# Altium schematic sheet [23] - SENSORS, CAN, IR.SchDoc
size A2; DocumentNumber: 23; SheetNumber: 23; SheetTotal: 32
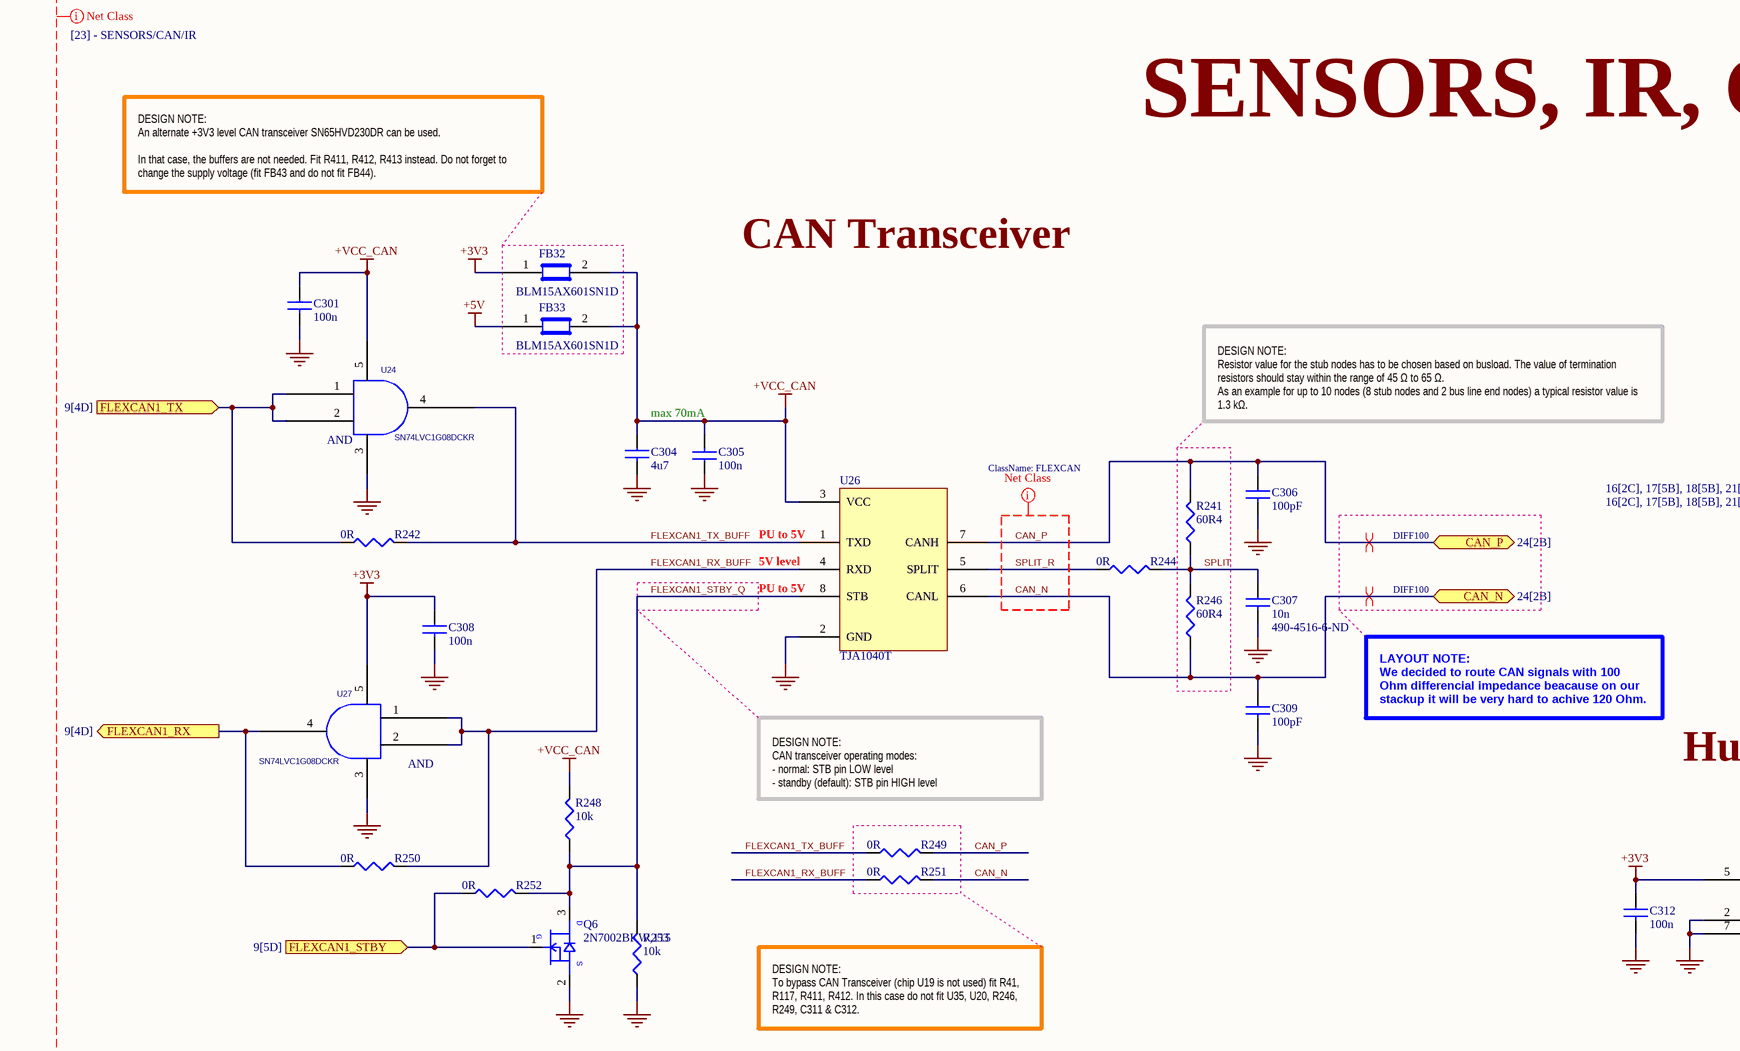
[diagram p0: [23] - SENSORS, CAN, IR.SchDoc, top left]
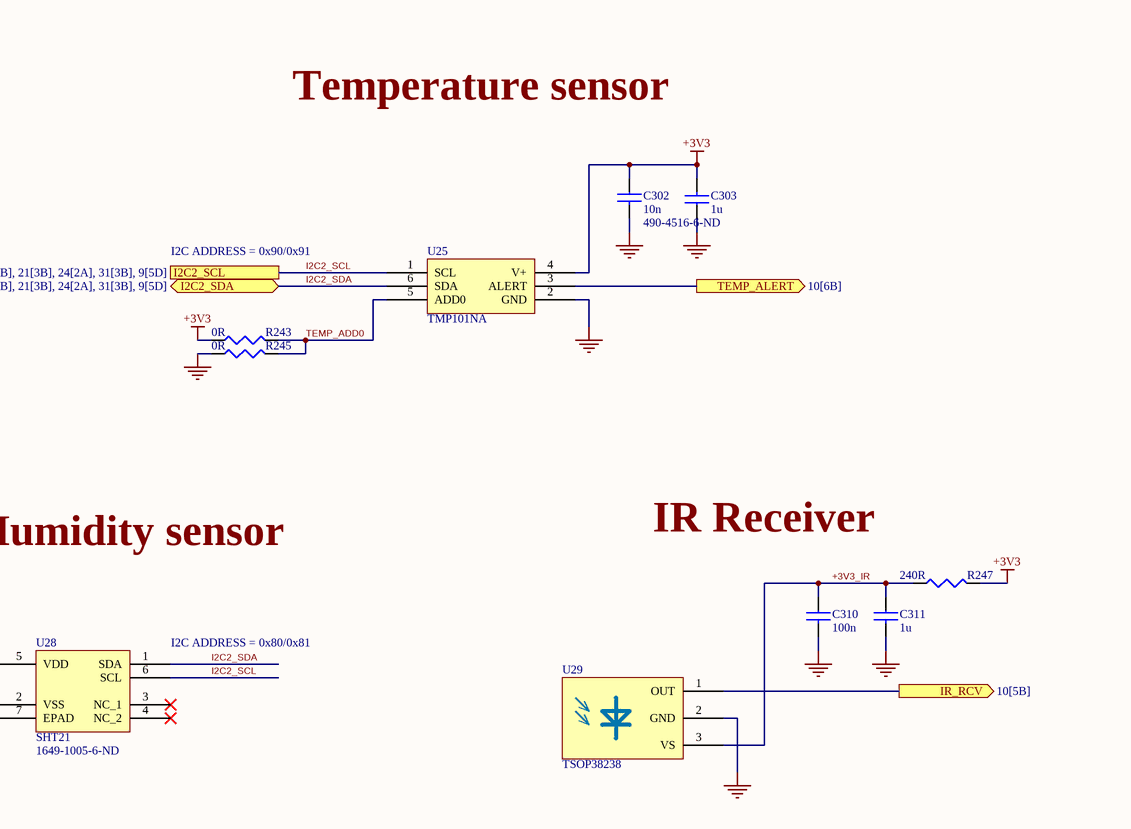
[diagram p1: [23] - SENSORS, CAN, IR.SchDoc, top right]
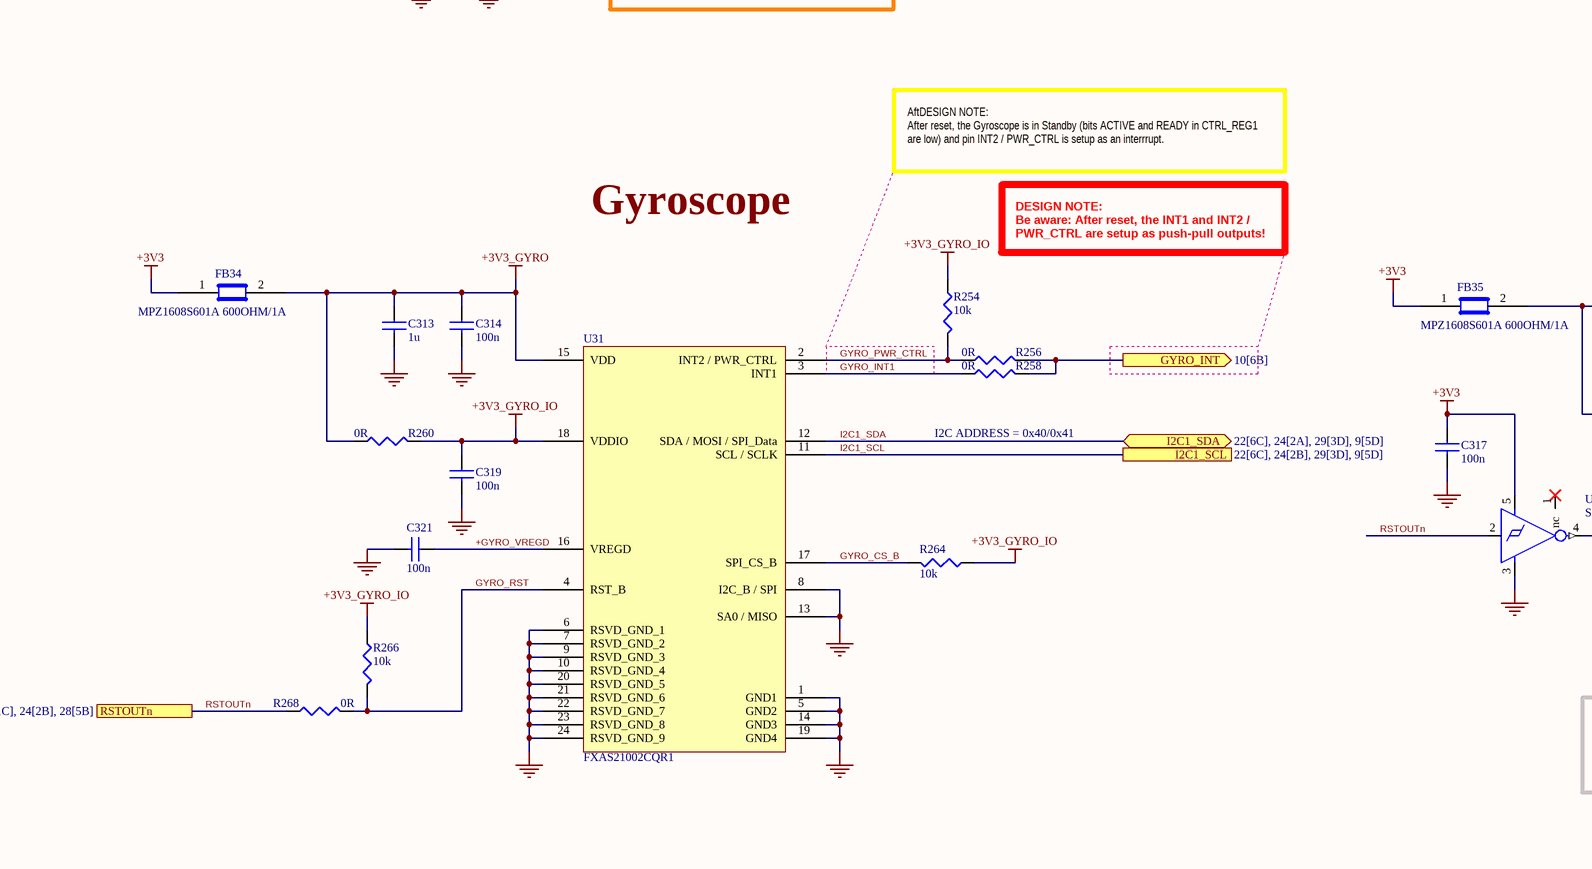
[diagram p2: [23] - SENSORS, CAN, IR.SchDoc, bottom left]
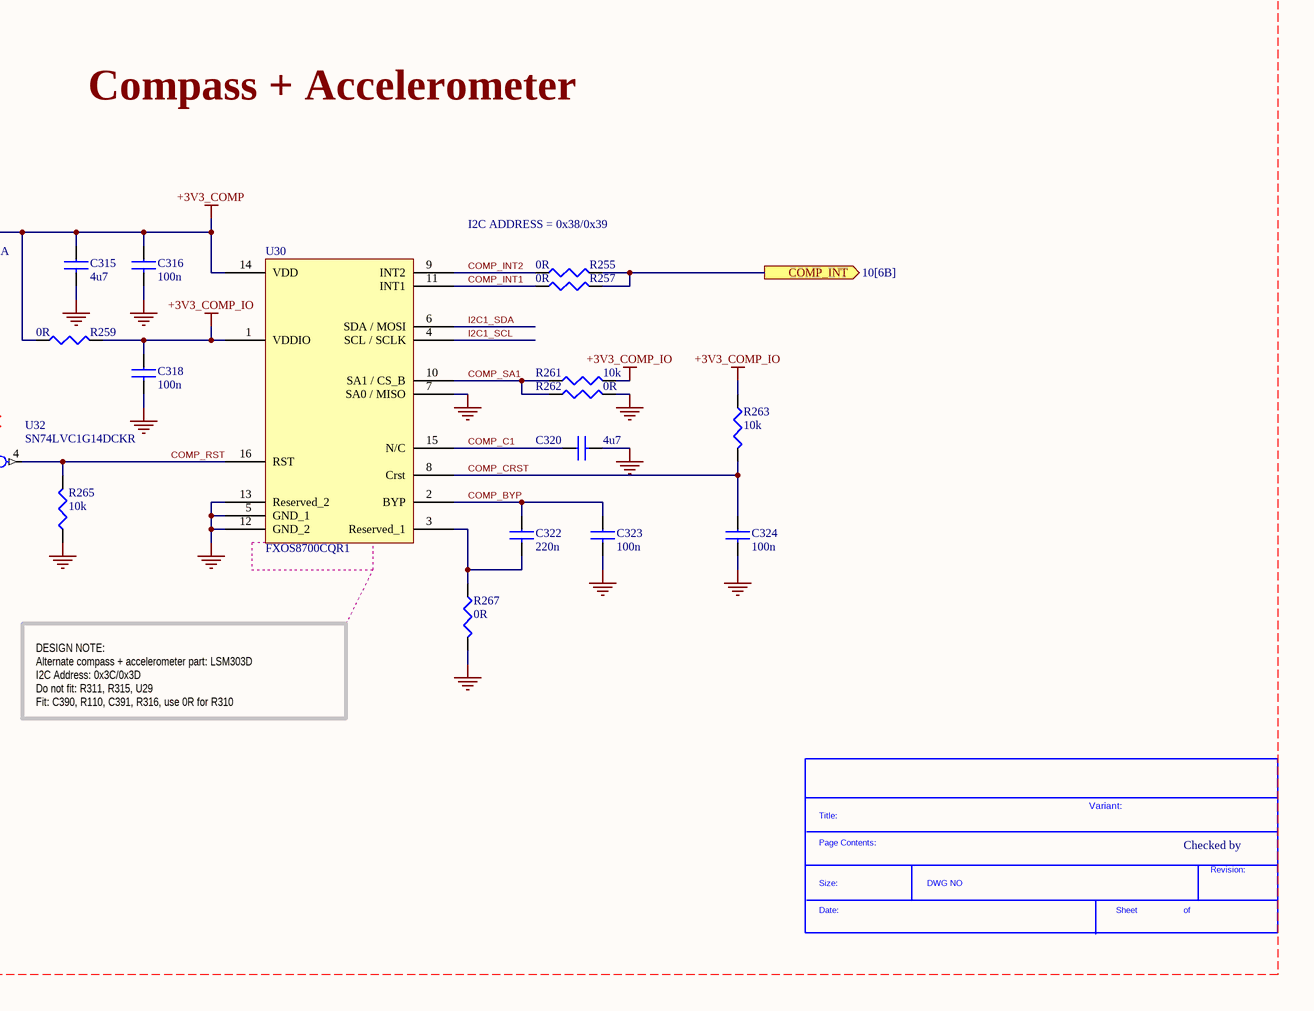
[diagram p3: [23] - SENSORS, CAN, IR.SchDoc, bottom right]

## Parts
*  SDTitleBlock  (value not drawn)  (graphical)
C301  100n  [C0402]
C302  10n  Supplier Part Number 2: 490-4516-6-ND  [C0402]
C303  1u  [C0402]
C304  4u7  [C0402]
C305  100n  [C0402]
C306  100pF  [C0402]
C307  10n  Supplier Part Number 2: 490-4516-6-ND  [C0402]
C308  100n  [C0402]
C309  100pF  [C0402]
C310  100n  [C0402]
C311  1u  [C0402]
C312  100n  [C0402]
C313  1u  [C0402]
C314  100n  [C0402]
C315  4u7  [C0402]
C316  100n  [C0402]
C317  100n  [C0402]
C318  100n  [C0402]
C319  100n  [C0402]
C320  4u7  [C0402]
C321  100n  [C0402]
C322  220n  [C0402]
C323  100n  [C0402]
C324  100n  [C0402]
FB32  BLM15AX601SN1D  [C0402]
FB33  BLM15AX601SN1D  [C0402]
FB34  MPZ1608S601A 600OHM/1A  [C0603]
FB35  MPZ1608S601A 600OHM/1A  [C0603]
Q6  2N7002BKW,115  [SC70_SOT323]
R241  60R4  [R0402]
R242  0R  [R0402]
R243  0R  [R0402]
R244  0R  [R0402]
R245  0R  [R0402]
R246  60R4  [R0402]
R247  240R  [R0402]
R248  10k  [R0402]
R249  0R  [R0402]
R250  0R  [R0402]
R251  0R  [R0402]
R252  0R  [R0402]
R253  10k  [R0402]
R254  10k  [R0402]
R255  0R  [R0402]
R256  0R  [R0402]
R257  0R  [R0402]
R258  0R  [R0402]
R259  0R  [R0402]
R260  0R  [R0402]
R261  10k  [R0402]
R262  0R  [R0402]
R263  10k  [R0402]
R264  10k  [R0402]
R265  10k  [R0402]
R266  10k  [R0402]
R267  0R  [R0402]
R268  0R  [R0402]
U24  SN74LVC1G08DCKR  [SC70_5]
U25  TMP101NA  [SOT23-6_DBV6]
U26  TJA1040T  [8_SOIC_3.9MM]
U27  SN74LVC1G08DCKR  [SC70_5]
U28  SHT21  Supplier Part Number 1: 1649-1005-6-ND  [6_DFN_3mmx3mm]
U29  TSOP38238  [TSOP382]
U30  FXOS8700CQR1  [QFN16_3x3mm]
U31  FXAS21002CQR1  [QFN24_4x4MM]
U32  SN74LVC1G14DCKR  [SC70_5]

## Ports
CAN_N (bidir, see 24[2B]), CAN_P (bidir, see 24[2B]), COMP_INT (out, see 10[6B]), FLEXCAN1_RX (out, see 9[4D]), FLEXCAN1_STBY (in, see 9[5D]), FLEXCAN1_TX (in, see 9[4D]), GYRO_INT (out, see 10[6B]), I2C1_SCL (see 22[6C], 24[2B], 29[3D], 9[5D]), I2C1_SDA (bidir, see 22[6C], 24[2A], 29[3D], 9[5D]), I2C2_SCL (see 16[2C], 17[5B], 18[5B], 21[3B], 24[2A], 31[3B], 9[5D]), I2C2_SDA (bidir, see 16[2C], 17[5B], 18[5B], 21[3B], 24[2A], 31[3B], 9[5D]), IR_RCV (out, see 10[5B]), RSTOUTn (see 11[6C], 14[4B], 19[1C], 24[2B], 28[5B]), TEMP_ALERT (out, see 10[6B])

## Nets
+3V3: C302.1 C303.2 C308.1 C312.1 C317.1 FB32.1 FB34.1 FB35.1 R243.1 R247.2 U25.4(V+) U27.5(VCC) U28.5(VDD) U32.5(NC1)
+3V3_COMP: C315.1 C316.1 FB35.2 R259.1 U30.14(VDD)
+3V3_COMP_IO: C318.1 R259.2 R261.2 R263.1 U30.1(VDDIO)
+3V3_GYRO: C313.1 C314.1 FB34.2 R260.1 U31.15(VDD)
+3V3_GYRO_IO: C319.1 R254.1 R260.2 R264.1 R266.1 U31.18(VDDIO)
+5V: FB33.1
+VCC_CAN: C301.1 C304.1 C305.2 FB32.2 FB33.2 R248.2 U24.5(VCC) U26.3(VCC)
GND: C301.2 C302.2 C303.1 C304.2 C305.1 C306.2 C307.2 C308.2 C309.2 C310.2 C311.2 C312.2 C313.2 C314.2 C315.2 C316.2 C317.2 C318.2 C319.2 C320.2 C321.2 C323.2 C324.2 Q6.2(SOURCE) R245.1 R253.1 R262.2 R265.1 R267.2 U24.3(GND) U25.2(GND) U26.2(GND) U27.3(GND) U28.2(VSS) U28.7(EPAD) U29.2(GND) U30.5(GND_1) U30.7(SA0_/_MISO) U30.12(GND_2) U30.13(Reserved_2) U31.1(GND1) U31.5(GND2) U31.6(RSVD_GND_1) U31.7(RSVD_GND_2) U31.8(I2C_B_/_SPI) U31.9(RSVD_GND_3) U31.10(RSVD_GND_4) U31.13(SA0_/_MISO) U31.14(GND3) U31.19(GND4) U31.20(RSVD_GND_5) U31.21(RSVD_GND_6) U31.22(RSVD_GND_7) U31.23(RSVD_GND_8) U31.24(RSVD_GND_9) U32.3(GND)
+3V3_IR: C310.1 C311.1 R247.1 U29.3(VS)
+GYRO_VREGD: C321.1 U31.16(VREGD)
CAN_N: C309.1 R246.1 R251.2 U26.6(CANL) ; port CAN_N
CAN_P: C306.1 R241.2 R249.2 U26.7(CANH) ; port CAN_P
COMP_BYP: C322.1 C323.1 U30.2(BYP)
COMP_C1: C320.1 U30.15(N/C)
COMP_CRST: C324.1 R263.2 U30.8(Crst)
COMP_INT: R255.2 R257.2 ; port COMP_INT
COMP_INT1: R257.1 U30.11(INT1)
COMP_INT2: R255.1 U30.9(INT2)
COMP_RST: R265.2 U30.16(RST) U32.4(O)
COMP_SA1: R261.1 R262.1 U30.10(SA1_/_CS_B)
FLEXCAN1_RX: R250.1 U27.4(Y) ; port FLEXCAN1_RX
FLEXCAN1_RX_BUFF: R250.2 R251.1 U26.4(RXD) U27.1(A) U27.2(B)
FLEXCAN1_STBY: Q6.1(GATE) R252.1 ; port FLEXCAN1_STBY
FLEXCAN1_STBY_Q: Q6.3(DRAIN) R248.1 R252.2 R253.2 U26.8(STB)
FLEXCAN1_TX: R242.1 U24.1(A) U24.2(B) ; port FLEXCAN1_TX
FLEXCAN1_TX_BUFF: R242.2 R249.1 U24.4(Y) U26.1(TXD)
GYRO_CS_B: R264.2 U31.17(SPI_CS_B)
GYRO_INT: R256.2 R258.2 ; port GYRO_INT
GYRO_INT1: R258.1 U31.3(INT1)
GYRO_PWR_CTRL: R254.2 R256.1 U31.2(INT2_/_PWR_CTRL)
GYRO_RST: R266.2 R268.2 U31.4(RST_B)
I2C1_SCL: U30.4(SCL_/_SCLK) U31.11(SCL_/_SCLK) ; port I2C1_SCL
I2C1_SDA: U30.6(SDA_/_MOSI) U31.12(SDA_/_MOSI_/_SPI_Data) ; port I2C1_SDA
I2C2_SCL: U25.1(SCL) U28.6(SCL) ; port I2C2_SCL
I2C2_SDA: U25.6(SDA) U28.1(SDA) ; port I2C2_SDA
IR_RCV: U29.1(OUT) ; port IR_RCV
RSTOUTn: R268.1 U32.2(I) ; port RSTOUTn
SPLIT: C307.1 R241.1 R244.2 R246.2
SPLIT_R: R244.1 U26.5(SPLIT)
TEMP_ADD0: R243.2 R245.2 U25.5(ADD0)
TEMP_ALERT: U25.3(ALERT) ; port TEMP_ALERT
NetC322_2: C322.2 R267.1 U30.3(Reserved_1)

Not connected (* = marked no-connect by the designer): U28 3(NC_1)* 4(NC_2)*; U32 1(nc)*

## Layout directives
net class FLEXCAN: CAN_N, CAN_P, SPLIT_R
differential pair; net class DIFF100: CAN_N, CAN_P
net class [23] - SENSORS/CAN/IR: +3V3, +3V3_COMP, +3V3_COMP_IO, +3V3_GYRO, +3V3_GYRO_IO, +3V3_IR, +5V, +GYRO_VREGD, +VCC_CAN, CAN_N, CAN_P, COMP_BYP, COMP_C1, COMP_CRST, COMP_INT1, COMP_INT2, COMP_RST, COMP_SA1, FLEXCAN1_RX_BUFF, FLEXCAN1_STBY_Q, FLEXCAN1_TX_BUFF, GND, GYRO_CS_B, GYRO_INT1, GYRO_PWR_CTRL, GYRO_RST, I2C1_SCL, I2C1_SDA, I2C2_SCL, I2C2_SDA, RSTOUTn, SPLIT, SPLIT_R, TEMP_ADD0

## Notes on the sheet
- SENSORS, IR, CAN
- DESIGN NOTE:
  An alternate +3V3 level CAN transceiver SN65HVD230DR can be used.
  In that case, the buffers are not needed. Fit R411, R412, R413 instead. Do not forget to change the supply voltage (fit FB43 and do not fit FB44).
- CAN Transceiver
- Temperature sensor
- max 70mA
- DESIGN NOTE:
  Resistor value for the stub nodes has to be chosen based on busload. The value of termination resistors should stay within the range of 45 Ω to 65 Ω.
  As an example for up to 10 nodes (8 stub nodes and 2 bus line end nodes) a typical resistor value is 1.3 kΩ.
- I2C ADDRESS = 0x90/0x91
- (near U26) PU to 5V
- (near U26) 5V level
- LAYOUT NOTE:
  We decided to route CAN signals with 100 Ohm differencial impedance beacause on our stackup it will be very hard to achive 120 Ohm.
- DESIGN NOTE:
  CAN transceiver operating modes:
  - normal: STB pin LOW level
  - standby (default): STB pin HIGH level
- Humidity sensor
- IR Receiver
- (near U28) I2C ADDRESS = 0x80/0x81
- DESIGN NOTE:
  To bypass CAN Transceiver (chip U19 is not used) fit R41, R117, R411, R412. In this case do not fit U35, U20, R246, R249, C311 & C312.
- AftDESIGN NOTE:
  After reset, the Gyroscope is in Standby (bits ACTIVE and READY in CTRL_REG1 are low) and pin INT2 / PWR_CTRL is setup as an interrrupt.
- Compass + Accelerometer
- Gyroscope
- DESIGN NOTE:
  Be aware: After reset, the INT1 and INT2 / PWR_CTRL are setup as push-pull outputs!
- I2C ADDRESS = 0x38/0x39
- I2C ADDRESS = 0x40/0x41
- DESIGN NOTE:
  Alternate compass + accelerometer part: LSM303D
  I2C Address: 0x3C/0x3D
  Do not fit: R311, R315, U29
  Fit: C390, R110, C391, R316, use 0R for R310
- Variant:
- Checked by
- (in symbol 2N7002BKW,115) D; G; S
- (in symbol SDTitleBlock) Title:; Page Contents:; Revision:; Size:; DWG NO; Date:; Sheet; of
- (in symbol SN74LVC1G08DCKR) AND

## Library data of the parts
C301 C305 C308 C310 C312 C314 C316-C319 C321 C323 C324 = C1005X5R1H104K: CAP CER .10UF 50V X5R 10% 0402; Manufacturer: TDK Corporation; Capacitance: 0.1µF; Value: 100nF; .Checked PCB: used; Category: Capacitors; Manufacturer Part Number: C1005X5R1H104K; Operating Temperature: -55°C ~ 85°C; Package / Case: 0402 (1005 Metric); Price 1k [$]: 0.02340; .Checked SCH: used; Voltage - Rated: 50V; Supplier Part Number: 445-5942-1-ND; Supplier: Digikey; Supplier 1: Digi-Key; Supplier Part Number 1: 445-5942-1-ND; RoHS: RoHS Compliant; Stock 1: 106926; Pricing 1: 1=0.27, 10=0.18, 100=0.072, 250=0.05176, 500=0.0369, 1000=0.027 (USD); Tolerance: ±10%; Temperature Coefficient: X5R; Mounting Type: Surface Mount, MLCC; Applications: General Purpose; Ratings: -; Size / Dimension: 0.039" L x 0.020" W (1.00mm x 0.50mm); Height - Seated (Max): -; Thickness (Max): 0.022" (0.55mm); Lead Spacing: -; Features: -; Packaging: Cut Tape (CT); Lead Style: -; ComponentLink1URL: http://www.tdk.co.jp/tefe02/e412_c.pdf; ComponentLink1Description: http://www.tdk.co.jp/tefe02/e412_c.pdf; Supplier 2: Digi-Key; Supplier Part Number 2: 311-1697-6-ND
C302 C307 = C1005X7R1H103K: CAP CER 10000PF 50V 10% X7R 0402; Manufacturer: TDK Corporation; Value: 10nF; .Checked PCB: used; Capacitance: 10000pF; Category: Capacitors; Supplier Part Number: 445-6850-1-ND; Manufacturer Part Number: C1005X7R1H103K; Operating Temperature: -55°C ~ 125°C; Package / Case: 0402 (1005 Metric); Price 1k [$]: 0.01625; .Checked SCH: used; Voltage - Rated: 50V; Supplier: Digikey; Supplier 1: Digi-Key; Supplier Part Number 1: 445-6850-1-ND; RoHS: RoHS Compliant; Stock 1: 3901; Pricing 1: 1=0.2, 10=0.125, 100=0.045, 250=0.03252, 500=0.024, 1000=0.01625 (USD); Tolerance: ±10%; Temperature Coefficient: X7R; Mounting Type: Surface Mount, MLCC; Applications: General Purpose; Ratings: -; Size / Dimension: 0.039" L x 0.020" W (1.00mm x 0.50mm); Height - Seated (Max): -; Thickness (Max): 0.022" (0.55mm); Lead Spacing: -; Features: -; Packaging: Cut Tape (CT); Lead Style: -; ComponentLink1URL: http://www.tdk.co.jp/tefe02/e412_c.pdf; ComponentLink1Description: http://www.tdk.co.jp/tefe02/e412_c.pdf; Supplier 2: Digi-Key
C303 C311 C313 = C1005X5R1C105K: CAP CER 1.0UF 16V X5R 0402; Manufacturer: TDK Corporation; Capacitance: 1.0µF; Value: 1uF; .Checked PCB: used; Tolerance: ±10%; Category: Capacitors; Supplier Part Number: 445-4978-1-ND; Manufacturer Part Number: C1005X5R1C105K; Operating Temperature: -55°C ~ 85°C; Package / Case: 0402 (1005 Metric); Price 1k [$]: 0.02080; .Checked SCH: used; Voltage - Rated: 16V; Supplier: Digikey; Supplier 1: Digi-Key; Supplier Part Number 1: 445-4978-1-ND; RoHS: RoHS Compliant; Stock 1: 341010; Pricing 1: 1=0.24, 10=0.16, 100=0.064, 250=0.046, 500=0.0328, 1000=0.024 (USD); Temperature Coefficient: X5R; Mounting Type: Surface Mount, MLCC; Applications: General Purpose; Ratings: -; Size / Dimension: 0.039" L x 0.020" W (1.00mm x 0.50mm); Height - Seated (Max): -; Thickness (Max): 0.022" (0.55mm); Lead Spacing: -; Features: -; Packaging: Cut Tape (CT); Lead Style: -; ComponentLink1URL: http://www.tdk.co.jp/tefe02/e412_c.pdf; ComponentLink1Description: http://www.tdk.co.jp/tefe02/e412_c.pdf; Supplier 2: Digi-Key; Supplier Part Number 2: 445-13181-1-ND
C304 C315 C320 = C1005X5R1A475M: CAP CER 4.7UF 10V 20% X5R 0402; Manufacturer: TDK Corporation; Capacitance: 4.7µF; .Checked PCB: used; Supplier 1: Digi-Key; Supplier Part Number 1: 445-8023-1-ND; Manufacturer Part Number: C1005X5R1A475M; RoHS: RoHS Compliant; Category: Capacitors; Stock 1: 10140; Pricing 1: 1=0.53, 10=0.415, 100=0.25, 250=0.18752, 500=0.16, 1000=0.125, 5000=0.095 (USD); Voltage - Rated: 10V; Tolerance: ±20%; Temperature Coefficient: X5R; Mounting Type: Surface Mount, MLCC; Operating Temperature: -55°C ~ 85°C; Applications: General Purpose; Ratings: -; Package / Case: 0402 (1005 Metric); Size / Dimension: 0.039" L x 0.020" W (1.00mm x 0.50mm); Height - Seated (Max): -; Thickness (Max): -; Lead Spacing: -; Features: -; Packaging: Cut Tape (CT); Lead Style: -; ComponentLink1URL: http://www.tdk.com/pdf/general_B11.pdf; ComponentLink1Description: http://www.tdk.com/pdf/general_B11.pdf; .Checked SCH: used
C306 C309 = C1005C0G1H101J: CAP CER 100PF 50V 5% NP0 0402; Manufacturer: TDK Corporation; Temperature Coefficient: C0G, NP0; .Checked PCB: used; Supplier 1: Digi-Key; Supplier Part Number 1: 490-7311-1-ND; Manufacturer Part Number: C1005C0G1H101J; RoHS: RoHS Compliant; Category: Capacitors; Capacitance: 100pF; Voltage - Rated: 50V; Tolerance: ±5%; Mounting Type: Surface Mount, MLCC; Operating Temperature: -55°C ~ 125°C; Applications: General Purpose; Ratings: -; Package / Case: 0402 (1005 Metric); Size / Dimension: 0.039" L x 0.020" W (1.00mm x 0.50mm); Height - Seated (Max): -; Thickness (Max): 0.022" (0.55mm); Lead Spacing: -; Features: -; Packaging: Cut Tape (CT); Lead Style: -; ComponentLink1URL: http://www.tdk.com/pdf/general_B11.pdf; ComponentLink1Description: http://www.tdk.com/pdf/general_B11.pdf; .Checked SCH: used; Supplier 2: Digi-Key; Supplier Part Number 2: 399-15922-1-ND
C322 = C1005X5R1E224M: CAP CER .22UF 25V X5R 20% 0402; Manufacturer: TDK Corporation; Capacitance: 0.22µF; Value: 220nF; .Checked PCB: used; Category: Capacitors; Supplier Part Number: 445-5945-1-ND; Manufacturer Part Number: C1005X5R1E224M; Operating Temperature: -55°C ~ 85°C; Package / Case: 0402 (1005 Metric); Price 1k [$]: 0.02600; .Checked SCH: used; Voltage - Rated: 25V; Supplier: Digikey; Supplier 1: Digi-Key; Supplier Part Number 1: 445-5945-1-ND; RoHS: RoHS Compliant; Stock 1: 54593; Pricing 1: 1=0.3, 10=0.2, 100=0.08, 250=0.05752, 500=0.041, 1000=0.03 (USD); Tolerance: ±20%; Temperature Coefficient: X5R; Mounting Type: Surface Mount, MLCC; Applications: General Purpose; Ratings: -; Size / Dimension: 0.039" L x 0.020" W (1.00mm x 0.50mm); Height - Seated (Max): -; Thickness (Max): 0.022" (0.55mm); Lead Spacing: -; Features: -; Packaging: Cut Tape (CT); Lead Style: -; ComponentLink1URL: http://www.tdk.co.jp/tefe02/e412_c.pdf; ComponentLink1Description: http://www.tdk.co.jp/tefe02/e412_c.pdf; Supplier 2: Digi-Key; Supplier Part Number 2: 587-1452-1-ND
FB32 FB33 = BLM15AX601SN1D: FERRITE CHIP 600 OHM 0402 420mA; Manufacturer: Murata Electronics North America; .Checked PCB: used; Impedance @ Frequency: 600 Ohm @ 100MHz; DC Resistance (DCR): 340 mOhm Max; Filter Type: Differential Mode - Single; Number of Lines: 1; .Checked SCH: used; Category: Filters; Supplier Part Number: 490-5441-1-ND; Manufacturer Part Number: BLM15AX601SN1D; Package / Case: 0402 (1005 Metric); Price 1k [$]: 0.03280; Value: BLM15AX601SN1D; Current Rating: 420mA; Supplier: Digikey; Supplier 1: Digi-Key; Supplier Part Number 1: 490-5441-1-ND; RoHS: RoHS Compliant; Stock 1: 34008; Pricing 1: 1=0.26, 10=0.197, 50=0.1148, 100=0.0918, 250=0.0656, 500=0.0446, 1000=0.03608, 5000=0.02821 (USD); Mounting Type: Surface Mount; Packaging: Cut Tape (CT); Height (Max): 0.022" (0.55mm); Size / Dimension: 0.039" L x 0.020" W (1.00mm x 0.50mm); ComponentLink1URL: http://search.murata.co.jp/Ceramy/image/img/PDF/ENG/L0110S0100BLM15AX_SN.pdf; ComponentLink1Description: http://search.murata.co.jp/Ceramy/image/img/PDF/ENG/L0110S0100BLM15AX_SN.pdf
FB34 FB35 = MPZ1608S601A: FERRITE CHIP BEAD 600 OHM SMD 1A; Manufacturer: TDK Corporation; Impedance @ Frequency: 600 Ohm @ 100MHz; DC Resistance (DCR): 150 mOhm Max; Filter Type: Differential Mode - Single; Number of Lines: 1; .Checked PCB: used; Supplier 1: Digi-Key; Supplier Part Number 1: 445-2205-1-ND; Manufacturer Part Number: MPZ1608S601A; RoHS: RoHS Compliant; Category: Filters; Stock 1: 328345; Pricing 1: 1=0.36, 10=0.24, 100=0.096, 250=0.069, 500=0.0492, 1000=0.036 (USD); Current Rating: 1A; Package / Case: 0603 (1608 Metric); Mounting Type: Surface Mount; Packaging: Cut Tape (CT); Height (Max): 0.037" (0.95mm); Size / Dimension: 0.063" L x 0.031" W (1.60mm x 0.80mm); ComponentLink1URL: http://www.tdk.co.jp/tefe02/e9413_mpz.pdf; ComponentLink1Description: http://www.tdk.co.jp/tefe02/e9413_mpz.pdf; .Checked SCH: used
Q6 = 2N7002BKW,115: MOSFET N-CH 60V 310MA SOT323; Manufacturer: NXP Semiconductors; FET Type: MOSFET N-Channel, Metal Oxide; FET Feature: Logic Level Gate; Rds On (Max) @ Id, Vgs: 1.6 Ohm @ 500mA, 10V; Vgs(th) (Max) @ Id: 2.1V @ 250µA; Gate Charge (Qg) @ Vgs: 0.6nC @ 4.5V; Input Capacitance (Ciss) @ Vds: 50pF @ 10V; Power - Max: 275mW; .Checked PCB: used; Supplier 1: Digi-Key; Supplier Part Number 1: 1727-4788-1-ND; Manufacturer Part Number: 2N7002BKW,115; RoHS: RoHS Compliant; Category: Discrete Semiconductor Products; Drain to Source Voltage (Vdss): 60V; Current - Continuous Drain (Id) @ 25° C: 310mA; Mounting Type: Surface Mount; Package / Case: SC-70, SOT-323; Supplier Device Package: SC-70; Packaging: Cut Tape (CT); ComponentLink1URL: http://www.nxp.com/documents/data_sheet/2N7002BKW.pdf; ComponentLink1Description: http://www.nxp.com/documents/data_sheet/2N7002BKW.pdf; .Checked SCH: used
R241 R246 = RC0402FR-0760R4L: RES 60.4 OHM 1% 1/16W 0402; Manufacturer: Yageo; Resistance (Ohms): 60.4; Power (Watts): 0.063W, 1/16W; Temperature Coefficient: ±100ppm/°C; .Creator: MM; .Checked PCB: used; Supplier 1: Digi-Key; Manufacturer Part Number: RC0402FR-0760R4L; RoHS: RoHS Compliant; Category: Resistors; Stock 1: 33933; Pricing 1: 1=0.1, 10=0.015, 25=0.0108, 100=0.006, 250=0.00456, 500=0.00364, 1000=0.00268, 2500=0.00233, 5000=0.00192 (USD); Packaging: Cut Tape (CT); Tolerance: ±1%; Composition: Thick Film; Features: Moisture Resistant; Operating Temperature: -55°C ~ 155°C; Package / Case: 0402 (1005 Metric); Supplier Device Package: 0402; Size / Dimension: 0.039" L x 0.020" W (1.00mm x 0.50mm); Height: 0.016" (0.40mm); Number of Terminations: 2; ComponentLink1URL: http://www.yageo.com/NewPortal/yageodocoutput?fileName=/pdf/R-Chip/PYu-RC_Group_51_RoHS_L_0.pdf; ComponentLink1Description: http://www.yageo.com/NewPortal/yageodocoutput?fileName=/pdf/R-Chip/PYu-RC_Group_51_RoHS_L_0.pdf; Supplier Part Number 1: 311-60.4LRCT-ND; .Checked SCH: used; Supplier 2: Digi-Key; Supplier Part Number 2: A124594CT-ND
R242-R245 R249-R252 R255-R260 R262 R267 R268 = RC0402JR-070RL: RES 0.0 OHM 1/16W 0402 SMD; Manufacturer: Yageo; Resistance (Ohms): 0.0; Power (Watts): 0.063W, 1/16W; Tolerance: Jumper; .Checked PCB: used; Category: Resistors; Supplier Part Number: 311-0.0JRCT-ND; Manufacturer Part Number: RC0402JR-070RL; Package / Case: 0402 (1005 Metric); Price 1k [$]: 0.01389; Value: 0R; .Checked SCH: used; Supplier: Digikey; Supplier 1: Digi-Key; Supplier Part Number 1: 311-0.0JRCT-ND; RoHS: RoHS Compliant; Stock 1: 1106330; Pricing 1: 10=0.012, 50=0.009, 100=0.0069, 250=0.00512, 500=0.0038, 1000=0.00253 (USD); Composition: Thick Film; Features: -; Temperature Coefficient: -; Size / Dimension: 0.039" L x 0.020" W (1.00mm x 0.50mm); Height: 0.016" (0.40mm); Number of Terminations: 2; Packaging: Cut Tape (CT); ComponentLink1URL: http://www.yageo.com/documents/recent/PYu-RC0402_51_RoHS_L_6.pdf; ComponentLink1Description: http://www.yageo.com/documents/recent/PYu-RC0402_51_RoHS_L_6.pdf
R247 = RMCF0402FT240R: RES TF 240 OHM 1% 0.0625W 0402; Manufacturer: Stackpole Electronics Inc; Resistance (Ohms): 240; Power (Watts): 0.063W, 1/16W; .Checked PCB: used; Temperature Coefficient: ±100ppm/°C; Category: Resistors; Supplier Part Number: RMCF0402FT240RCT-ND; Manufacturer Part Number: RMCF0402FT240R; Package / Case: 0402 (1005 Metric); Price 1k [$]: 0.00384; Tolerance: ±1%; Value: 240R; .Checked SCH: used; Supplier: Digikey; Supplier 1: Digi-Key; Supplier Part Number 1: RMCF0402FT240RCT-ND; RoHS: RoHS Compliant; Stock 1: 39860; Pricing 1: 1=0.04, 10=0.025, 50=0.0138, 100=0.0105, 250=0.0078, 500=0.00576, 1000=0.00384 (USD); Composition: Thick Film; Features: -; Size / Dimension: 0.039" L x 0.020" W (1.00mm x 0.50mm); Height: 0.016" (0.40mm); Number of Terminations: 2; Packaging: Cut Tape (CT); ComponentLink1URL: http://www.seielect.com/Catalog/SEI-RMCF.pdf; ComponentLink1Description: http://www.seielect.com/Catalog/SEI-RMCF.pdf
R248 R253 R254 R261 R263-R266 = RC0402FR-0710KL: RES 10.0K OHM 1/16W 1% 0402 SMD; Manufacturer: Yageo; Power (Watts): 0.063W, 1/16W; .Checked PCB: used; Temperature Coefficient: ±100ppm/°C; Category: Resistors; Supplier Part Number: 311-10.0KLRCT-ND; Manufacturer Part Number: RC0402FR-0710KL; Package / Case: 0402 (1005 Metric); Price 1k [$]: 0.01421; Resistance (Ohms): 10K; Tolerance: ±1%; Value: 10k; .Checked SCH: used; Supplier: Digikey; Supplier 1: Digi-Key; Supplier Part Number 1: 311-10.0KLRCT-ND; RoHS: RoHS Compliant; Stock 1: 2916495; Pricing 1: 10=0.014, 50=0.0104, 100=0.0079, 250=0.00584, 500=0.00432, 1000=0.00288 (USD); Composition: Thick Film; Features: -; Size / Dimension: 0.039" L x 0.020" W (1.00mm x 0.50mm); Height: 0.016" (0.40mm); Number of Terminations: 2; Packaging: Cut Tape (CT); ComponentLink1URL: http://www.yageo.com/documents/recent/PYu-RC0402_51_RoHS_L_6.pdf; ComponentLink1Description: http://www.yageo.com/documents/recent/PYu-RC0402_51_RoHS_L_6.pdf
U24 U27 = SN74LVC1G08DCKR: SINGLE POSITIVE AND GATE SC-70; Manufacturer: Texas Instruments; .Checked PCB: used; Number of Inputs: 2; Voltage - Supply: 1.65 V ~ 5.5 V; Number of Circuits: 1; Current - Output High, Low: 32mA, 32mA; .Checked SCH: used; Category: Integrated Circuits (ICs); Supplier Part Number: 296-11602-1-ND; Family: Logic - Gates and Inverters; Manufacturer Part Number: SN74LVC1G08DCKR; Operating Temperature: -40°C ~ 85°C; Package / Case: 6-TSSOP (5 lead), SC-88A, SOT-353; Price 1k [$]: 0.11250; Value: SN74LVC1G08DCKR; Logic Type: AND Gate; Supplier: Digikey; Supplier 1: Digi-Key; Supplier Part Number 1: 296-11602-1-ND; RoHS: RoHS Compliant; Stock 1: 36212; Pricing 1: 1=0.7, 25=0.322, 100=0.224, 250=0.1596, 500=0.1218, 1000=0.084 (USD); Mounting Type: Surface Mount; Supplier Device Package: SC-70-5; Packaging: Cut Tape (CT); ComponentLink1URL: http://www.ti.com/lit/ds/symlink/sn74lvc1g08.pdf; ComponentLink1Description: http://www.ti.com/lit/ds/symlink/sn74lvc1g08.pdf
U25 = TMP101NA: IC DIGITAL TEMP SENSOR SOT23-6; Manufacturer: Texas Instruments; Manufacturer Part Number: TMP101NA/3K; Function: Temp Monitoring System (Sensor); Sensor Type: Internal; Sensing Temperature: -55°C ~ 125°C; Accuracy: ±3°C(Max); Topology: ADC (Sigma Delta), Register Bank; Output Type: I²C™/SMBus™; Output Alarm: Yes; Output Fan: No; Voltage - Supply: 2.7 V ~ 5.5 V; .Checked PCB: used; Supplier 1: Digi-Key; Supplier Part Number 1: 296-27725-1-ND; RoHS: RoHS Compliant; Category: Integrated Circuits (ICs); Stock 1: 3233; Pricing 1: 1=2.55, 10=2.304, 25=2.064, 100=1.856, 250=1.648, 500=1.44, 1000=1.192 (USD); Operating Temperature: -55°C ~ 125°C; Mounting Type: Surface Mount; Package / Case: SOT-23-6; Supplier Device Package: SOT-23-6; Packaging: Cut Tape (CT); ComponentLink1URL: http://www.ti.com/lit/ds/symlink/tmp100.pdf; ComponentLink1Description: http://www.ti.com/lit/ds/symlink/tmp100.pdf; .Checked SCH: used
U26 = TJA1040T/CM,118: IC TRANSCEIVER CAN 8SOIC; Manufacturer: NXP Semiconductors; Number of Drivers/Receivers: 1/1; Duplex: Half; Receiver Hysteresis: 70mV; Voltage - Supply: 4.75 V ~ 5.25 V; .Creator: MM; .Checked PCB: used; Supplier 1: Digi-Key; Manufacturer Part Number: TJA1040T/CM,118; RoHS: RoHS Compliant; Category: Integrated Circuits (ICs); Stock 1: 2927; Pricing 1: 1=1.32, 10=1.169, 25=1.0552, 100=0.9233, 250=0.80976, 500=0.71814, 1000=0.56792 (USD); Packaging: Cut Tape (CT); Type: Transceiver; Protocol: CAN; Data Rate: -; Operating Temperature: -; Mounting Type: Surface Mount; Package / Case: 8-SOIC (0.154", 3.90mm Width); Supplier Device Package: 8-SO; ComponentLink1URL: http://www.nxp.com/documents/data_sheet/TJA1040.pdf; ComponentLink1Description: http://www.nxp.com/documents/data_sheet/TJA1040.pdf; Supplier Part Number 1: 568-10289-1-ND; .Checked SCH: used
U28 = SHT21: SENSIRION - SHT21 - SENSOR, HUMIDITY & TEMP, 3X3MM, 2%; Humidity Range: 0% to 100; Sensitivity: ± 1%; Sensor Output1: Digital; Sensor Terminals: SMD; Response Time: 5; Supply Voltage Min: 2.1; Supply Voltage Max: 3.6; .Creator: MM; .Checked PCB: used; Supplier 1: Digi-Key; Manufacturer: SENSIRION; Manufacturer Part Number: SHT21; RoHS: YES; Sensing Accuracy: 2%; Capacitance: -; Operating Temperature Min: -40; Operating Temperature Max: 125; MSL: MSL 1 - Unlimited<!--FANDB--><div class="features-and-benefits-container"></div>; ComponentLink1URL: http://www.farnell.com/datasheets/1780639.pdf; ComponentLink1Description: http://www.farnell.com/datasheets/1780639.pdf; ComponentLink2URL: http://www.farnell.com/cad/1670197.zip; ComponentLink2Description: http://www.farnell.com/cad/1670197.zip; Category: Integrated Circuits (ICs); .Checked SCH: used
U29 = TSOP38238: IC IR RCVR MOD 38KHZ DOME AXIAL; Manufacturer: Vishay Semiconductor Opto Division; Sensing Distance: 45m; B.P.F. Center Frequency: 38.0kHz; Voltage - Supply: 2.5 V ~ 5.5 V; Current - Supply: 450µA; .Creator: MM; .Checked PCB: used; Supplier 1: Digi-Key; Manufacturer Part Number: TSOP38238; RoHS: RoHS Compliant; Category: Sensors, Transducers; Stock 1: 4083; Pricing 1: 1=1.12, 10=0.878, 25=0.756, 50=0.6548, 100=0.594, 250=0.54, 500=0.4995, 1000=0.4455, 2500=0.432 (USD); Orientation: Side View; Mounting Type: Through Hole; ComponentLink1URL: http://www.vishay.com/docs/82491/tsop382.pdf; ComponentLink1Description: http://www.vishay.com/docs/82491/tsop382.pdf; Supplier Part Number 1: 751-1227-ND; .Checked SCH: used
U30 = FXOS8700CQR1: SENSOR XTRINSIC 6-AXIS QFN; Manufacturer: Freescale Semiconductor; Sensor Type: Accelerometer, Magnetometer, 3 Axis; Output Type: I²C, SPI; .Checked PCB: used; .Creator: MM; Supplier 1: Digi-Key; Manufacturer Part Number: FXOS8700CQR1; RoHS: RoHS Compliant; Category: Sensors, Transducers; Stock 1: 6201; Pricing 1: 1=2.63, 10=2.35, 25=2.2092, 100=2.115, 250=2.021, 500=1.88 (USD); ComponentLink1URL: http://cache.freescale.com/files/sensors/doc/data_sheet/FXOS8700CQ.pdf; ComponentLink1Description: http://cache.freescale.com/files/sensors/doc/data_sheet/FXOS8700CQ.pdf; Supplier Part Number 1: FXOS8700CQR1CT-ND; .Checked SCH: used; Supplier 2: Mouser; Supplier Part Number 2: 841-FXOS8700CQR1
U31 = FXAS21002CQR1: GYROSCOPE 3-AXIS 24QFN; Manufacturer: Freescale Semiconductor; Range °/s: ±250°/s, ±500°/s, ±1000°/s, ±2000°/s; Sensitivity: 0.0078°/s/LSB, 0.0156°/s/LSB, 0.0312°/s/LSB, 0.0625°/s/LSB; Typical Bandwidth: 400Hz; Voltage - Supply: 1.95 V ~ 3.6 V; Current - Supply: 2.7mA; Output Type: I²C, SPI; .Checked PCB: used; .Creator: MM; Supplier 1: Digi-Key; Manufacturer Part Number: FXAS21002CQR1; RoHS: RoHS Compliant; Category: Sensors, Transducers; Stock 1: 1703; Pricing 1: 1=3.56, 10=3.175, 25=2.9844, 100=2.8575, 250=2.73052, 500=2.54 (USD); Operating Temperature: -40°C ~ 85°C; Package / Case: 24-TFQFN Exposed Pad; Supplier Device Package: 24-QFN (4x4); ComponentLink1URL: http://cache.freescale.com/files/sensors/doc/data_sheet/FXAS21002.pdf; ComponentLink1Description: http://cache.freescale.com/files/sensors/doc/data_sheet/FXAS21002.pdf; Supplier Part Number 1: FXAS21002CQR1CT-ND; .Checked SCH: used
U32 = SN74LVC1G14DCKR: IC SGL SCHMT-TRIG INVERT SC70-5; Manufacturer: Texas Instruments; Logic Type: Inverter; Number of Circuits: 1; Voltage - Supply: 1.65 V ~ 5.5 V; Current - Quiescent (Max): 10µA; Current - Output High, Low: 32mA, 32mA; Logic Level - Low: 0.39 V ~ 1.87 V; Logic Level - High: 1.16 V ~ 3.33 V; Max Propagation Delay @ V, Max CL: 5ns @ 5V, 50pF; .Checked PCB: used; .Creator: MM; Supplier 1: Digi-Key; Manufacturer Part Number: SN74LVC1G14DCKR; RoHS: RoHS Compliant; Category: Integrated Circuits (ICs); Stock 1: 49135; Pricing 1: 1=0.49, 10=0.284, 100=0.134, 1000=0.103 (USD); Packaging: Cut Tape (CT); Number of Inputs: 1; Features: Schmitt Trigger; Operating Temperature: -40°C ~ 85°C; Mounting Type: Surface Mount; Supplier Device Package: SC-70-5; Package / Case: 5-TSSOP, SC-70-5, SOT-353; ComponentLink1URL: http://www.ti.com/lit/ds/symlink/sn74lvc1g14.pdf; ComponentLink1Description: http://www.ti.com/lit/ds/symlink/sn74lvc1g14.pdf; Supplier Part Number 1: 296-11608-1-ND; .Checked SCH: used